# EAGLE schematic SensorStation Board v0.5 (EAGLE 7.7.0)
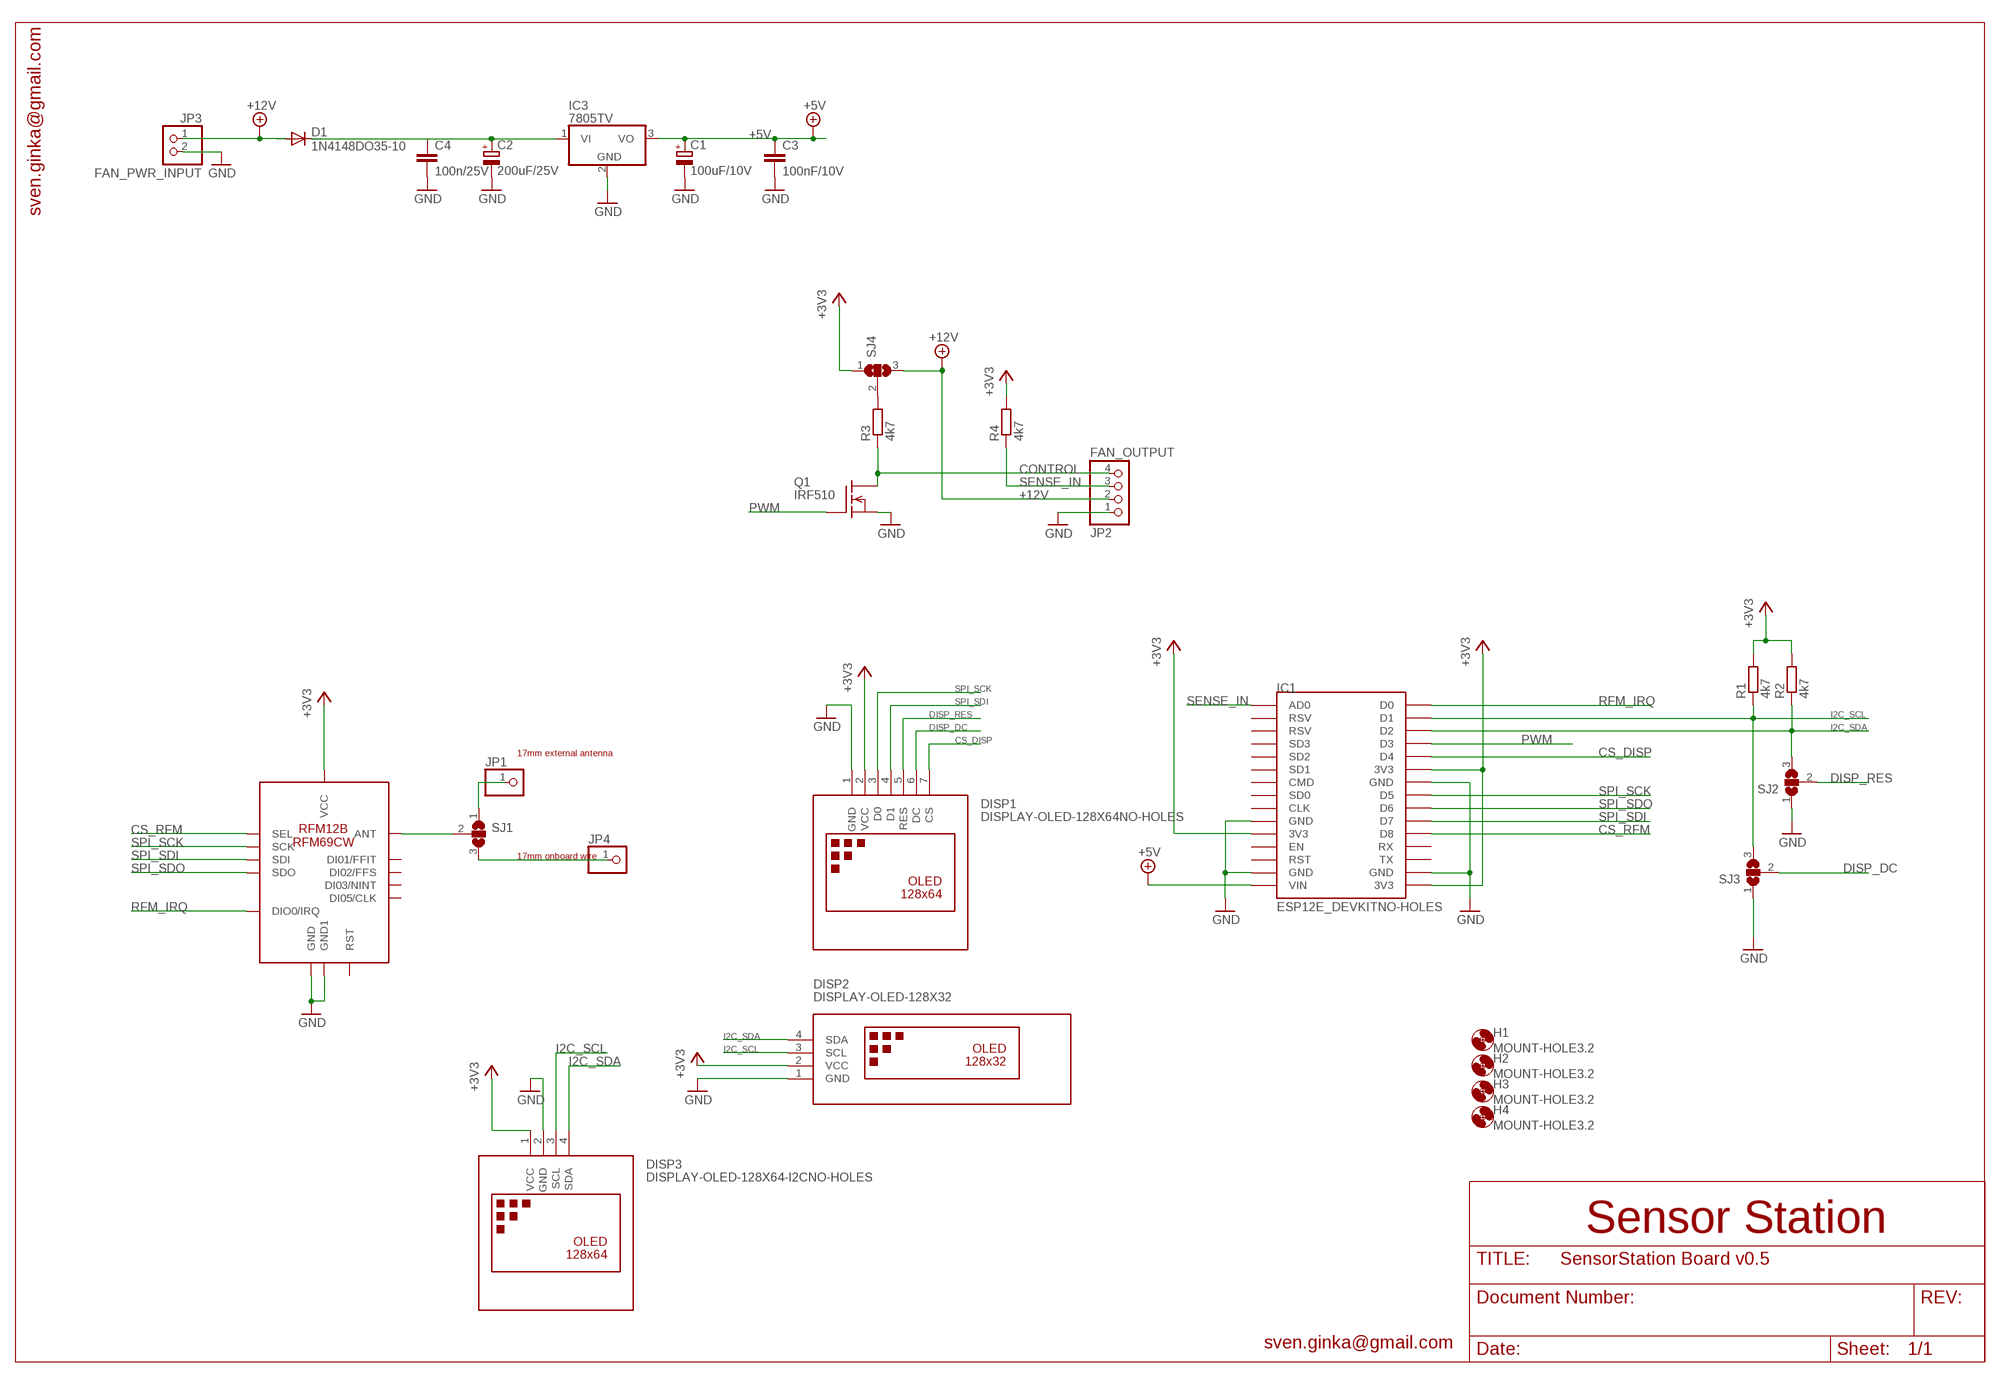
[diagram p0: schematic, sheet 1]

## Parts
C1  100uF/10V  CPOL-EUE2.5-6  [E2,5-6]
C2  200uF/25V  CPOL-EUE2.5-6  [E2,5-6]
C3  100nF/10V  C-EU025-025X050  [C025-025X050]
C4  100n/25V  C-EU025-025X050  [C025-025X050]
D1  1N4148DO35-10  [DO35-10]
DISP1  DISPLAY-OLED-128X64NO-HOLES  [DISPLAY-OLED-128X64-NO-HOLES]
DISP2  DISPLAY-OLED-128X32  [DISPLAY-OLED-128X32]
DISP3  DISPLAY-OLED-128X64-I2CNO-HOLES  [DISPLAY-OLED-128X64-I2C-NO-HOLES]
H1  MOUNT-HOLE3.2  [3,2]
H2  MOUNT-HOLE3.2  [3,2]
H3  MOUNT-HOLE3.2  [3,2]
H4  MOUNT-HOLE3.2  [3,2]
IC1  ESP12E_DEVKITNO-HOLES  [ESP12E_DEVKIT-NO-HOLES]
IC2  RFM12B/69CW  [RFM12B/69CW]
IC3  7805TV  [TO220V]
JP1  PINHD-1X1  [1X01]
JP2  FAN_OUTPUT  PINHD-1X4  [1X04]
JP3  FAN_PWR_INPUT  PINHD-1X2  [1X02]
JP4  PINHD-1X1  [1X01]
Q1  IRF510  [TO220]
R1  4k7  R-EU_0204/5  [0204/5]
R2  4k7  R-EU_0204/5  [0204/5]
R3  4k7  R-EU_0204/5  [0204/5]
R4  4k7  R-EU_0204/5  [0204/5]
SJ1  SJ2W  [SJ_2]
SJ2  SJ2W  [SJ_2]
SJ3  SJ2W  [SJ_2]
SJ4  SJ2W  [SJ_2]

## Nets
12V_INTERNAL: C2.+ C4.1 D1.C IC3.1(VI)
+3V3: DISP1.2(VCC) DISP2.2(VCC) DISP3.1(VCC) IC1.3V3@0(3V3) IC1.3V3@1(3V3) IC1.3V3@2(3V3) IC2.VDD(VCC) R1.2 R2.2 R4.2 SJ4.1
+5V: C1.+ C3.1 IC1.VIN IC3.3(VO)
+12V: D1.A JP2.2 JP3.1 SJ4.3
ANTENNA: JP4.1 SJ1.3
CONTROL: JP2.4 Q1.2(D) R3.1
CS_DISP: DISP1.7(CS) IC1.D4
CS_RFM: IC1.D8 IC2.SEL
DISP_DC: DISP1.6(DC) SJ3.2
DISP_RES: DISP1.5(RES) SJ2.2
EXT_ANTENNA: JP1.1 SJ1.1
GND: C1.- C2.- C3.2 C4.2 DISP1.1(GND) DISP2.1(GND) DISP3.2(GND) IC1.GND@0(GND) IC1.GND@1(GND) IC1.GND@2(GND) IC1.GND@3(GND) IC2.GND IC2.GND1 IC3.2(GND) JP2.1 JP3.2 Q1.3(S) SJ2.1 SJ3.1
I2C_SCL: DISP2.3(SCL) DISP3.3(SCL) IC1.D1 R1.1 SJ3.3
I2C_SDA: DISP2.4(SDA) DISP3.4(SDA) IC1.D2 R2.1 SJ2.3
N$1: IC2.ANT SJ1.2
N$3: R3.2 SJ4.2
PWM: IC1.D3 Q1.1(G)
RFM_IRQ: IC1.D0 IC2.IRQ(DIO0/IRQ)
SENSE_IN: IC1.AD0 JP2.3 R4.1
SPI_SCK: DISP1.3(D0) IC1.D5 IC2.SCK
SPI_SDI: DISP1.4(D1) IC1.D7 IC2.SDI
SPI_SDO: IC1.D6 IC2.SDO
Unconnected: IC1.CLK IC1.CMD IC1.EN IC1.RST IC1.RSV@0(RSV) IC1.RSV@1(RSV) IC1.RX IC1.SD0 IC1.SD1 IC1.SD2 IC1.SD3 IC1.TX IC2.CLK(DI05/CLK) IC2.FFIT(DI01/FFIT) IC2.FFS(DI02/FFS) IC2.NINT(DI03/NINT) IC2.RST

## Notes on the sheet
- sven.ginka@gmail.com
- 17mm external antenna
- 17mm onboard wire
- Sensor Station
- sven.ginka@gmail.com

## Library data of the parts
C1 C2 = rcl:CPOL-EU: POLARIZED CAPACITOR, European symbol
C3 C4 = rcl:C-EU: CAPACITOR, European symbol
D1 = diode:1N4148: DIODE high speed (Philips)
DISP1 = diy-modules:DISPLAY-OLED-128X64: 128x64 Dot Matrix OLED Module Click here to find device on ebay.com <http://www.ebay.com/sch/oled+display+128x64> Note: There are two variants: I2C and SPI. Search for the proper version.
DISP2 = diy-modules:DISPLAY-OLED-128X32: 128x32 Dot Matrix OLED Module with I2C interface based on SSD1306 chip More details available here: http://www.tinyosshop.com/index.php?route=product/product&product_id=953 Schematic available here: http://www.tinyosshop.com/datasheet/OLED%2012832.pdf SSD1306 datasheet: https://cdn-shop.adafruit.com/datasheets/SSD1306.pdf Click here to find device on ebay.com <http://www.ebay.com/sch/oled+display+128x32+i2c>
DISP3 = diy-modules:DISPLAY-OLED-128X64-I2C: OLED 0.96" 128x64 I2C Display ebay http://www.ebay.de/itm/0-96-OLED-LCD-Display-Weiss-I2C-128X64-fuer-Arduino-Mikrokontroller-/301943930819
H1-H4 = holes:MOUNT-HOLE: MOUNTING HOLE with drill center marker
IC1 = ESP12E_DEVKIT:ESP12E_DEVKIT: ESP12E DEVKIT BOARD
IC2 = JeeLabs:RFM12B/69CW
IC3 = linear:78*: Positive VOLTAGE REGULATOR Source: http://cache.national.com/ds/LM/LM78L05.pdf http://www.fairchildsemi.com/ds/LM/LM7805.pdf
JP1 JP4 = pinhead:PINHD-1X1: PIN HEADER
JP2 = pinhead:PINHD-1X4: PIN HEADER
JP3 = pinhead:PINHD-1X2: PIN HEADER
Q1 = transistor-fet:IRF510: N-Channel Enhancement MOSFET (HEXFET); 100V; 5,6A; 0,54Ohm
R1-R4 = rcl:R-EU_: RESISTOR, European symbol
SJ1-SJ4 = jumper:SJ2W: SMD solder JUMPER